# Altium project L298n.PrjPCB
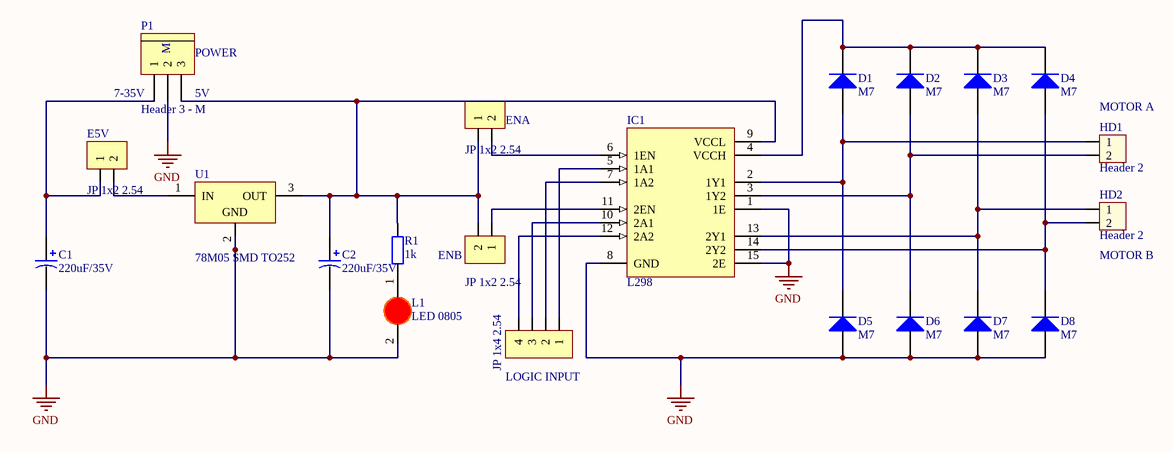
[diagram p0: Sch_L298n.SchDoc]
1 sheet, 21 parts. Net scope: global (net labels, ports and power ports of the same name join across sheets).
Board file: PCB_L298n.PcbDoc

## Sheet Sch_L298n.SchDoc
size A

### Parts
C1  220uF/35V  [CAP_ALUM_SMD_80102_TYPE_F]
C2  220uF/35V  [CAP_ALUM_SMD_80102_TYPE_F]
D1  M7  [DIODE SMA]
D2  M7  [DIODE SMA]
D3  M7  [DIODE SMA]
D4  M7  [DIODE SMA]
D5  M7  [DIODE SMA]
D6  M7  [DIODE SMA]
D7  M7  [DIODE SMA]
D8  M7  [DIODE SMA]
HD1  Header 2  [HED2]
HD2  Header 2  [HED2]
IC1  L298  [DIP15SL2]
JP1  JP 1x2 2.54  [JP 1x2 CT]
JP2  JP 1x2 2.54  [JP 1x2 CT]
JP3  JP 1x2 2.54  [JP 1x2 CT]
JP4  JP 1x4 2.54  [JP 1x4 DT]
L1  LED 0805  [LED-0805-Red]
P1  Header 3 - M  [Medium - Header 3]
R1  1k  [tro smd 0603]
U1  78M05 SMD TO252  [TO252]

### Nets
GND: C1.2 C2.2 D5.1(A) D6.1(A) D7.1(A) D8.1(A) IC1.1(1E) IC1.8(GND) IC1.15(2E) L1.2(K) P1.2 U1.2(GND)
NetC1_1: C1.1 JP2.1 P1.1
NetC2_1: C2.1 IC1.9(VCCL) JP1.1 JP3.2 P1.3 R1.2 U1.3(OUT)
NetD1_1: D1.1(A) D5.2(K) HD1.1 IC1.2(1Y1)
NetD1_2: D1.2(K) D2.2(K) D3.2(K) D4.2(K) IC1.4(VCCH)
NetD2_1: D2.1(A) D6.2(K) HD1.2 IC1.3(1Y2)
NetD3_1: D3.1(A) D7.2(K) HD2.1 IC1.13(2Y1)
NetD4_1: D4.1(A) D8.2(K) HD2.2 IC1.14(2Y2)
NetIC1_5: IC1.5(1A1) JP4.1
NetIC1_6: IC1.6(1EN) JP1.2
NetIC1_7: IC1.7(1A2) JP4.2
NetIC1_10: IC1.10(2A1) JP4.3
NetIC1_11: IC1.11(2EN) JP3.1
NetIC1_12: IC1.12(2A2) JP4.4
NetJP2_2: JP2.2 U1.1(IN)
NetL1_1: L1.1(A) R1.1

### Notes on the sheet
- (near P1) POWER
- (near JP2) E5V
- (near P1) 7-35V
- (near P1) 5V
- (near JP1) ENA
- (near HD1) MOTOR A
- ENB
- (near HD2) MOTOR B
- (near JP4) LOGIC INPUT
- (in symbol Header 3 - M) M

### Library data of the parts
C1 C2 = EEE-FK1V221P: CAP ALUM 220uF 20% 35V SMD; MFR: Panasonic; Solder: SMT; Value: 220uF/35V; MPN: EEE-FK1V221P; Category: CAPACITOR; PinCount: 2
D1-D8 = Diode M7 ( 4007 ): Dán; Don_Vi: Con; Ten_Linh_Kien: Diode M7 1N4007 SMD 1A 1000V; Ma_Hang: MH000944; Chung_Loai: Dán; Ghi_Chu: *
HD1 HD2 = Hed2: Header 2 (Green); Value: Header 2
IC1 = L298: Dual Full-H Driver; Note: The tab is elec is connected to GND pin; Published: 15-May-2002; DatasheetVersion: Jun-1990; PackageReference: KV015; Publisher: Altium Limited; PackageDescription: TO, Thru-Hole, Vertical, Heatsink Mounted; 15 Bent Staggered Leads; Pitch 1.27 mm; ComponentLink1Description: Manufacturer Link; ComponentLink1URL: http://www.ti.com/
JP1-JP3 = JP 1x2 2.54 Cai Thang: Cắm; Ten_Linh_Kien: Jump Đơn Cái 2.54MM 1x20P Thẳng; Don_Vi: Con; Ma_Hang: MH004006; Ghi_Chu: *; Kieu_Chan: *; Chung_Loai: Cắm
JP4 = JP 1x4 2.54 Duc Thang: Cắm; Ten_Linh_Kien: Jump Đơn Đực 2.54MM 1x40P Thẳng 11MM; Don_Vi: Con; Ma_Hang: MH000903; Ghi_Chu: *; Kieu_Chan: *; Chung_Loai: Cắm
L1 = LED 0805 Do: Dán; Don_Vi: Con; Ma_Hang: MH000897; Ten_Linh_Kien: LED 0805 Màu Đỏ (Red); Ghi_Chu: *; Kieu_Chan: *; Chung_Loai: Dán
P1 = Header 3 - M: Header, 3-Pin, Medium; LatestRevisionDate: 17-Jul-2002; LatestRevisionNote: Re-released for DXP Platform.; Publisher: Altium Limited
R1 = Tro 0603 5% 1k: Dán; Don_Vi: Con; So_Chan: 2; Ten_Linh_Kien: Trở 0603 5% 1k; Ma_Hang: MH006319; Chung_Loai: Dán; Kieu_Chan: *
U1 = 78M05 SMD TO252: Dán; Don_Vi: Con; Ten_Linh_Kien: 78M05 TO252; Ma_Hang: MH001917; Ghi_Chu: *; Kieu_Chan: *; Chung_Loai: Dán